# EAGLE design HST1d_2018_FERAL_TECHNOLOGIES (EAGLE 8.6.0)
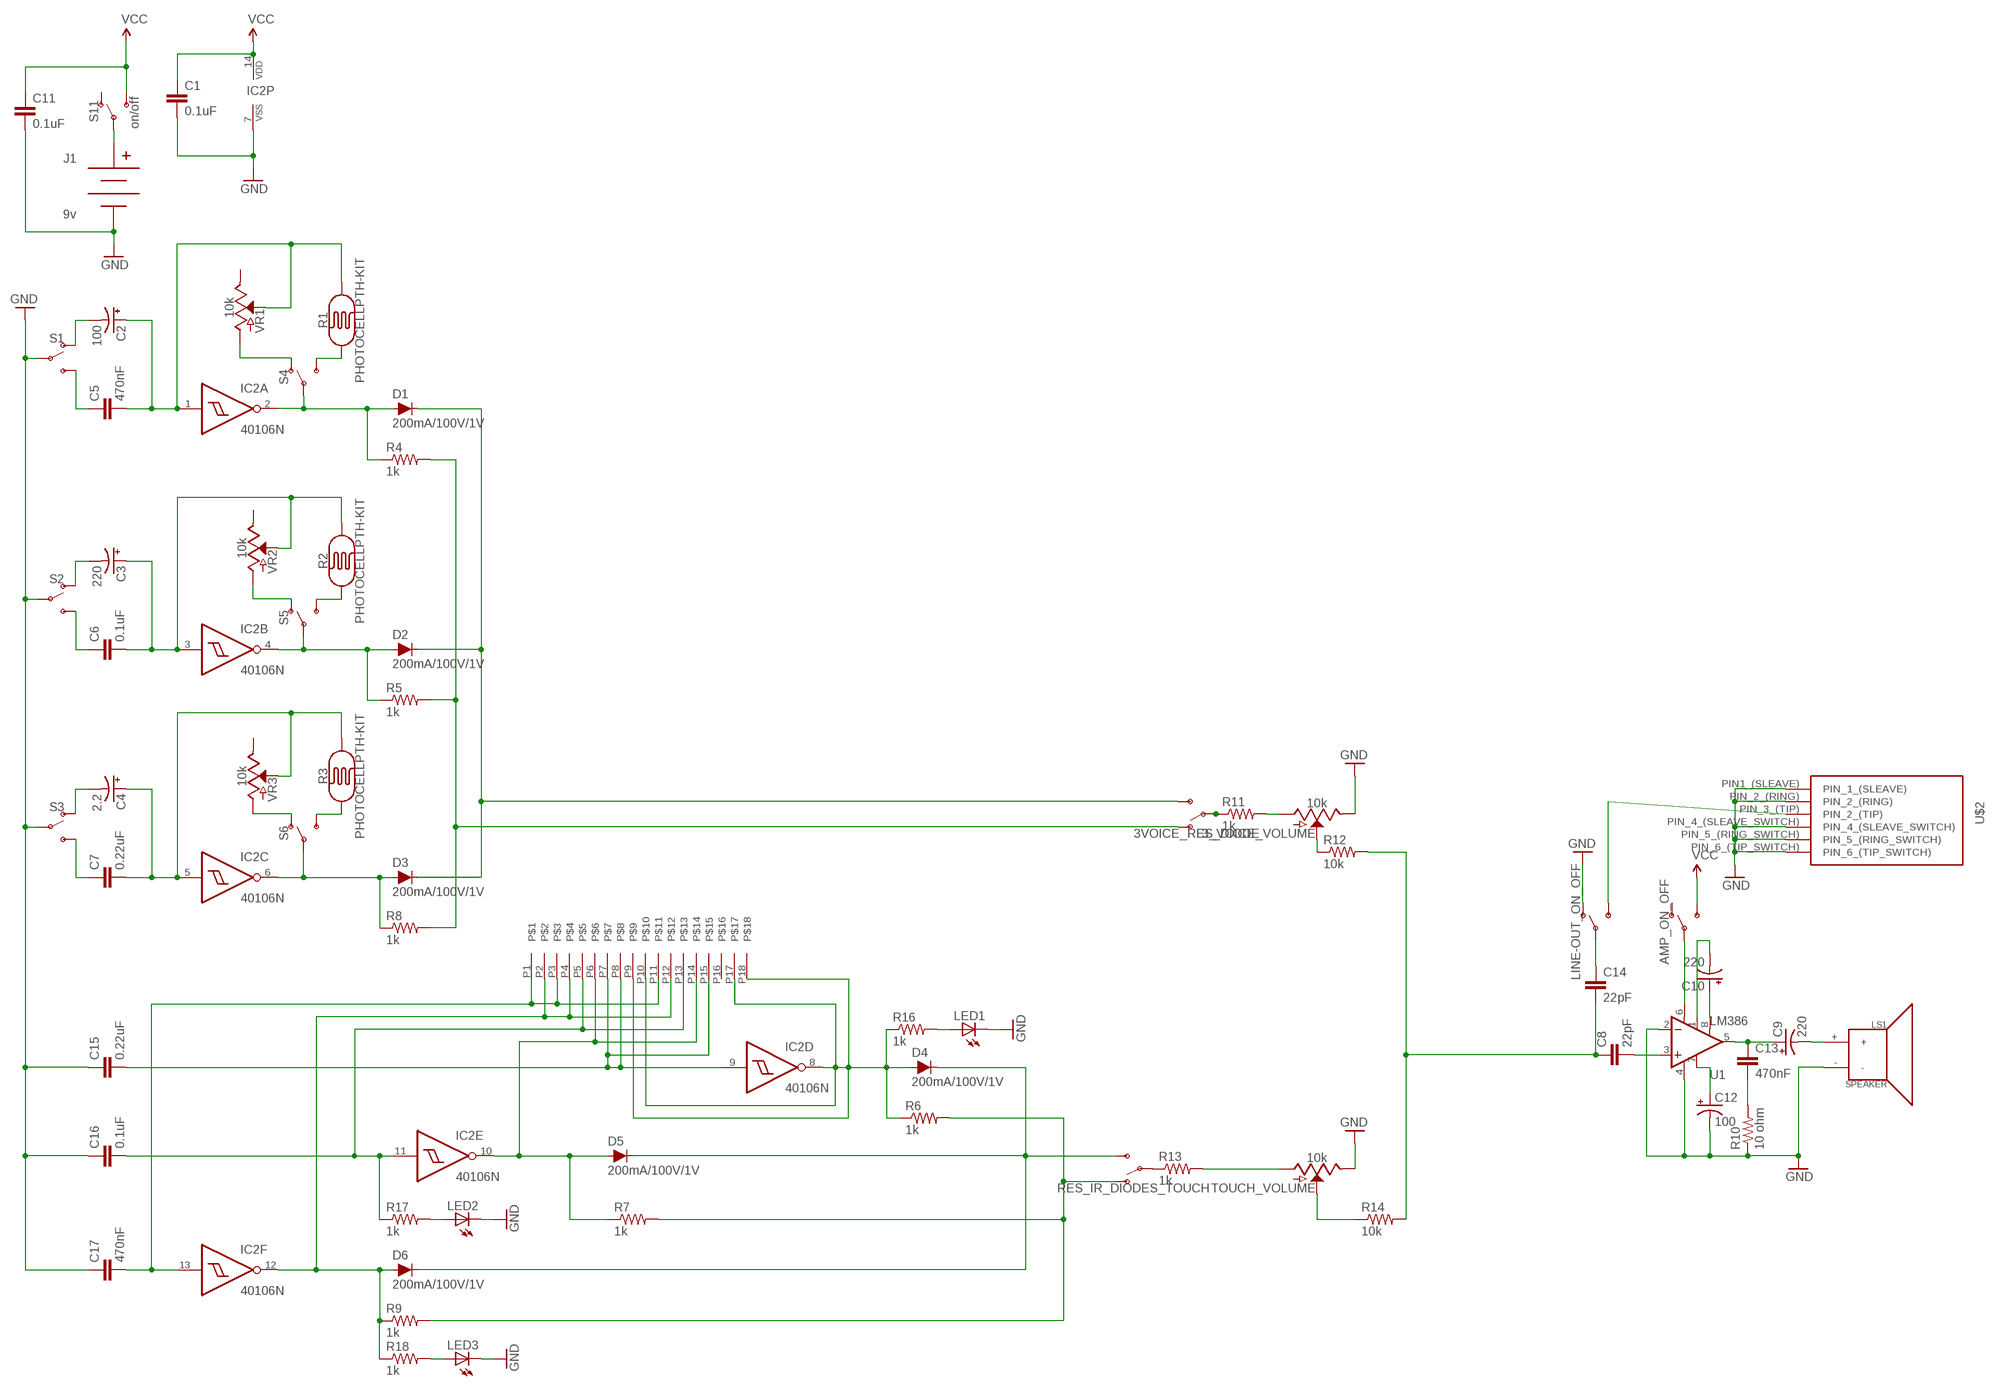
[diagram p0: schematic, sheet 1]

## Parts
3_VOICE_VOLUME  10k  POTENTIOMETER-PTH-9MM-1/20W-20%  [POT-PTH-ALPS]
3VOICE_RES_DIODE  SWITCH-SPDT-PTH-11.6X4.0MM  [SWITCH_SPDT_PTH_11.6X4.0MM]
AMP_ON_OFF  SWITCH-SPDT-PTH-11.6X4.0MM  [SWITCH_SPDT_PTH_11.6X4.0MM]
C1  0.1uF  0.1UF-KIT-EZ-50V-20%  [CAP-PTH-SMALL-KIT]
C2  100  CAP_POLPTH1  [CPOL-RADIAL-100UF-25V]
C3  220  CAP_POLPTH1  [CPOL-RADIAL-100UF-25V]
C4  2.2  CAP_POLPTH1  [CPOL-RADIAL-100UF-25V]
C5  470nF  0.1UF-50V-20%(PTH)KIT-EZ  [CAP-PTH-SMALL-KIT]
C6  0.1uF  0.1UF-50V-20%(PTH)KIT-EZ  [CAP-PTH-SMALL-KIT]
C7  0.22uF  0.1UF-50V-20%(PTH)KIT-EZ  [CAP-PTH-SMALL-KIT]
C8  22pF  22PF-PTH-2.54MM-200V-5%  [CAP-PTH-2.54]
C9  220  CAP_POLPTH1  [CPOL-RADIAL-100UF-25V]
C10  220  CAP_POLPTH1  [CPOL-RADIAL-100UF-25V]
C11  0.1uF  0.1UF-KIT-EZ-50V-20%  [CAP-PTH-SMALL-KIT]
C12  100  CAP_POLPTH1  [CPOL-RADIAL-100UF-25V]
C13  470nF  CAPEZ  [CAP-PTH-SMALLEZ]
C14  22pF  22PF-PTH-2.54MM-200V-5%  [CAP-PTH-2.54]
C15  0.22uF  0.1UF-50V-20%(PTH)KIT-EZ  [CAP-PTH-SMALL-KIT]
C16  0.1uF  0.1UF-50V-20%(PTH)KIT-EZ  [CAP-PTH-SMALL-KIT]
C17  470nF  0.1UF-50V-20%(PTH)KIT-EZ  [CAP-PTH-SMALL-KIT]
D1  200mA/100V/1V  DIODE-1N4148  [DIODE-1N4148]
D2  200mA/100V/1V  DIODE-1N4148  [DIODE-1N4148]
D3  200mA/100V/1V  DIODE-1N4148  [DIODE-1N4148]
D4  200mA/100V/1V  DIODE-1N4148  [DIODE-1N4148]
D5  200mA/100V/1V  DIODE-1N4148  [DIODE-1N4148]
D6  200mA/100V/1V  DIODE-1N4148  [DIODE-1N4148]
IC2  40106N  [DIL14]
J1  9v  BC9VPC  [BC9VPC]
LED1  LED5MM  [LED5MM]
LED2  LED5MM  [LED5MM]
LED3  LED5MM  [LED5MM]
LINE-OUT_ON_OFF  SWITCH-SPDT-PTH-11.6X4.0MM  [SWITCH_SPDT_PTH_11.6X4.0MM]
LS1  SPEAKER  [PCB_MOUNT_SPEAKER]
R1  PHOTOCELLPTH-KIT  [PHOTOCELL-KIT]
R2  PHOTOCELLPTH-KIT  [PHOTOCELL-KIT]
R3  PHOTOCELLPTH-KIT  [PHOTOCELL-KIT]
R4  1k  RESISTORPTH-1/4W  [AXIAL-0.4]
R5  1k  RESISTORPTH-1/4W  [AXIAL-0.4]
R6  1k  RESISTORPTH-1/4W  [AXIAL-0.4]
R7  1k  RESISTORPTH-1/4W  [AXIAL-0.4]
R8  1k  RESISTORPTH-1/4W  [AXIAL-0.4]
R9  1k  RESISTORPTH-1/4W  [AXIAL-0.4]
R10  10 ohm  RESISTORPTH-1/4W  [AXIAL-0.4]
R11  1k  RESISTORPTH-1/4W  [AXIAL-0.4]
R12  10k  RESISTORPTH-1/4W  [AXIAL-0.4]
R13  1k  RESISTORPTH-1/4W  [AXIAL-0.4]
R14  10k  RESISTORPTH-1/4W  [AXIAL-0.4]
R16  1k  RESISTORPTH-1/4W  [AXIAL-0.4]
R17  1k  RESISTORPTH-1/4W  [AXIAL-0.4]
R18  1k  RESISTORPTH-1/4W  [AXIAL-0.4]
RES_IR_DIODES_TOUCH  SWITCH-SPDT-PTH-11.6X4.0MM  [SWITCH_SPDT_PTH_11.6X4.0MM]
S1  SWITCH-SPDT-PTH-11.6X4.0MM  [SWITCH_SPDT_PTH_11.6X4.0MM]
S2  SWITCH-SPDT-PTH-11.6X4.0MM  [SWITCH_SPDT_PTH_11.6X4.0MM]
S3  SWITCH-SPDT-PTH-11.6X4.0MM  [SWITCH_SPDT_PTH_11.6X4.0MM]
S4  SWITCH-SPDT-PTH-11.6X4.0MM  [SWITCH_SPDT_PTH_11.6X4.0MM]
S5  SWITCH-SPDT-PTH-11.6X4.0MM  [SWITCH_SPDT_PTH_11.6X4.0MM]
S6  SWITCH-SPDT-PTH-11.6X4.0MM  [SWITCH_SPDT_PTH_11.6X4.0MM]
S11  on/off  SWITCH-SPDT-PTH-11.6X4.0MM  [SWITCH_SPDT_PTH_11.6X4.0MM]
TOUCH_VOLUME  10k  POTENTIOMETER-PTH-9MM-1/20W-20%  [POT-PTH-ALPS]
U1  LM386  [DIP08]
U$1  MT_TOUCH_POINT  [TOUCH_POINT]
U$2  0.25_INCH_TRS_SWITCHED_AUDIO_SOCKET  [0.25INCH_AUDIO_SOCKET]
VR1  10k  POTENTIOMETER-PTH-9MM-1/20W-20%  [POT-PTH-ALPS]
VR2  10k  POTENTIOMETER-PTH-9MM-1/20W-20%  [POT-PTH-ALPS]
VR3  10k  POTENTIOMETER-PTH-9MM-1/20W-20%  [POT-PTH-ALPS]

## Nets
GND: 3_VOICE_VOLUME.P$1(E) C1.2 C11.2 C12.2(-) C15.1 C16.1 C17.1 IC2.7(P:VSS) J1.V- LED1.K(C) LED2.K(C) LED3.K(C) LINE-OUT_ON_OFF.1(O) LS1.- R10.P$1 S1.2(P) S2.2(P) S3.2(P) TOUCH_VOLUME.P$1(E) U1.2(-IN) U1.4(V-) U$2.PIN1_(SLEAVE)(PIN_1_(SLEAVE)) U$2.PIN_2_(RING) U$2.PIN_4_(SLEAVE_SWITCH) U$2.PIN_5_(RING_SWITCH) U$2.PIN_6_(TIP_SWITCH)
N$1: C2.2(-) S1.1(O)
N$2: C3.2(-) S2.1(O)
N$3: C4.2(-) S3.1(O)
N$4: C5.1 S1.3(S)
N$5: C2.1(+) C5.2 IC2.1(A:I) R1.2 VR1.P$2(S)
N$6: C6.1 S2.3(S)
N$7: D2.A IC2.4(B:O) R5.P$1 S5.2(P)
N$8: C7.1 S3.3(S)
N$9: R1.1 S4.3(S)
N$10: D3.A IC2.6(C:O) R8.P$1 S6.2(P)
N$11: S4.1(O) VR1.P$3(A)
N$12: D1.A IC2.2(A:O) R4.P$1 S4.2(P)
N$13: R6.P$2 R7.P$2 R9.P$2 RES_IR_DIODES_TOUCH.1(O)
N$14: S5.1(O) VR2.P$3(A)
N$15: R2.1 S5.3(S)
N$16: R3.1 S6.3(S)
N$17: C3.1(+) C6.2 IC2.3(B:I) R2.2 VR2.P$2(S)
N$18: C4.1(+) C7.2 IC2.5(C:I) R3.2 VR3.P$2(S)
N$19: 3_VOICE_VOLUME.P$2(S) R12.P$1
N$20: 3VOICE_RES_DIODE.3(S) D1.C D2.C D3.C
N$21: LINE-OUT_ON_OFF.3(S) U$2.PIN_3_(TIP)(PIN_2_(TIP))
N$22: R14.P$1 TOUCH_VOLUME.P$2(S)
N$23: 3VOICE_RES_DIODE.1(O) R4.P$2 R5.P$2 R8.P$2
N$24: C15.2 IC2.9(D:I) U$1.P7 U$1.P8 U$1.P15
N$25: C14.1 LINE-OUT_ON_OFF.2(P)
N$26: LED2.A R17.P$2
N$27: C9.1(+) C13.1 U1.5(OUT)
N$28: D4.A IC2.8(D:O) R6.P$1 R16.P$1 U$1.P9 U$1.P10 U$1.P17 U$1.P18
N$29: J1.V+ S11.2(P)
N$30: D5.A IC2.10(E:O) R7.P$1 U$1.P6 U$1.P14
N$31: R13.P$2 TOUCH_VOLUME.P$3(A)
N$32: C8.2 U1.3(+IN)
N$33: C9.2(-) LS1.+
N$34: C12.1(+) U1.7(BP)
N$35: S6.1(O) VR3.P$3(A)
N$36: C10.1(+) U1.8(GAIN)
N$37: C10.2(-) U1.1(GAIN)
N$38: C13.2 R10.P$2
N$39: C8.1 C14.2 R12.P$2 R14.P$2
N$40: D6.A IC2.12(F:O) R9.P$1 R18.P$1 U$1.P2 U$1.P4 U$1.P12
N$41: AMP_ON_OFF.2(P) U1.6(V+)
N$42: LED1.A R16.P$2
N$43: D4.C D5.C D6.C RES_IR_DIODES_TOUCH.3(S)
N$44: C16.2 IC2.11(E:I) R17.P$1 U$1.P5 U$1.P13
N$45: R13.P$1 RES_IR_DIODES_TOUCH.2(P)
N$46: C17.2 IC2.13(F:I) U$1.P1 U$1.P3 U$1.P11
N$47: LED3.A R18.P$2
N$48: 3_VOICE_VOLUME.P$3(A) R11.P$2
RES_OR_DIODES_3_VOICES: 3VOICE_RES_DIODE.2(P) R11.P$1
VCC: AMP_ON_OFF.3(S) C1.1 C11.1 IC2.14(P:VDD) S11.3(S)
Unconnected: AMP_ON_OFF.1(O) S11.1(O) U$1.P16 VR1.P$1(E) VR2.P$1(E) VR3.P$1(E)

## Library data of the parts
3_VOICE_VOLUME TOUCH_VOLUME VR1-VR3 = SparkFun-Resistors:POTENTIOMETER: Potentiometer (Pot) Three-terminal potentiometers, with an adjustable wiper and two adjustable resistors. A pot can be used to create a configurable voltage divider, or as a variable resistor. Variants ALPS_POT and ALPS_POT_KIT - PTH, breadboard compatible, 9mm square pots Rotary Potentiometer - Linear (10k ohm) <https://www.sparkfun.com/products/9288> (COM-09288) The KIT variant exposes copper on only one side of the PTH pad, so the part can only be assembled on one side of the PCB. Useful for beginner soldering kits.; PROD_ID: RES-09177; SF_SKU: COM-09288
3VOICE_RES_DIODE AMP_ON_OFF LINE-OUT_ON_OFF RES_IR_DIODES_TOUCH S1-S6 S11 = SparkFun-Switches:SWITCH-SPDT: Single Pole, Double Throw (SPDT) Switch Single-pole, double-throw (SPDT) switch. Variant Overview SMD-AYZ0202 Surface Mount DPDT Switch <https://www.sparkfun.com/products/597> (COM-00597) Used on e.g. LilyPad Arduino USB - ATmega32U4 Board <https://www.sparkfun.com/products/12049> PTH-11.6X4.0MM SPDT Mini Power Switch <https://www.sparkfun.com/products/102> (COM-00102) Used on e.g. SparkFun Simon Says - Through-Hole Soldering Kit <https://www.sparkfun.com/products/10547> (KIT-10547) PTH-11.6X4.0MM-KIT KIT version of SPDT Mini Power Switch - Simplifies soldering by removing tStop of switch pins - only one side can be soldered. PTH-11.6X4.0MM-LOCK LOCK version of SPDT Mini Power Switch - Offset pins hold switch in place for easier soldering. SMD-RIGHT-ANGLE Surface Mount Right Angle Switch <https://www.sparkfun.com/products/10860> (COM-10860) Used on e.g. SparkFun ESP8266 Thing <https://www.sparkfun.com/products/13231>; PROD_ID: SWCH-08261; SF_SKU: COM-00102
C1 C11 = SparkFun-Capacitors:0.1UF: 0.1µF ceramic capacitors A capacitor is a passive two-terminal electrical component used to store electrical energy temporarily in an electric field.; PROD_ID: CAP-08370
C2-C4 C10 = SparkFun-Capacitors:CAP_POL: Capacitor Polarized These are standard SMD and PTH capacitors. Normally 10uF, 47uF, and 100uF in electrolytic and tantalum varieties. Always verify the external diameter of the through hole cap, it varies with capacity, voltage, and manufacturer. The EIA devices should be standard.
C5-C7 C15-C17 = SparkFun-Capacitors:0.1UF-50V-20%(PTH): CAP-08370; PROD_ID: CAP-08370
C8 C14 = SparkFun-Capacitors:22PF: 22pF ceramic capacitors A capacitor is a passive two-terminal electrical component used to store electrical energy temporarily in an electric field.; PROD_ID: CAP-09128
C9 C12 = SparkFun-Passives:CAP_POL: Capacitor Polarized These are standard SMD and PTH capacitors. Normally 10uF, 47uF, and 100uF in electrolytic and tantalum varieties. Always verify the external diameter of the through hole cap, it varies with capacity, voltage, and manufacturer. The EIA devices should be standard.
C13 = SparkFun-Capacitors:CAP: Capacitor Standard 0603 ceramic capacitor, and 0.1" leaded capacitor.
D1-D6 = SparkFun-DiscreteSemi:DIODE: Diode These are standard reverse protection diodes and small signal diodes. SparkFun Products: SparkFun SparkPunk Sound Kit <https://www.sparkfun.com/products/11177> SparkFun ESP8266 Thing <https://www.sparkfun.com/products/13231>; PROD_ID: DIO-08378
IC2 = 40xx:40106: Hex SCHMITT TRIGGER
J1 = SparkFun-Connectors:BC9VPC: 9V Battery Holder - PC Mount Standard and Kit footprints included SparkFun Products: SparkFun SparkPunk Sound Kit <https://www.sparkfun.com/products/11177> SparkFun SparkPunk Sequencer Kit <https://www.sparkfun.com/products/12707>; PROD_ID: BATT-10855
LED1-LED3 = led:LED: LED OSRAM: - CHIPLED LG R971, LG N971, LY N971, LG Q971, LY Q971, LO R971, LY R971 LH N974, LH R974 LS Q976, LO Q976, LY Q976 LO Q996 - Hyper CHIPLED LW Q18S LB Q993, LB Q99A, LB R99A - SideLED LS A670, LO A670, LY A670, LG A670, LP A670 LB A673, LV A673, LT A673, LW A673 LH A674 LY A675 LS A676, LA A676, LO A676, LY A676, LW A676 LS A679, LY A679, LG A679 - Hyper Micro SIDELED® LS Y876, LA Y876, LO Y876, LY Y876 LT Y87S - SmartLED LW L88C, LW L88S LB L89C, LB L89S, LG L890 LS L89K, LO L89K, LY L89K LS L896, LA L896, LO L896, LY L896 - TOPLED LS T670, LO T670, LY T670, LG T670, LP T670 LSG T670, LSP T670, LSY T670, LOP T670, LYG T670 LG T671, LOG T671, LSG T671 LB T673, LV T673, LT T673, LW T673 LH T674 LS T676, LA T676, LO T676, LY T676, LB T676, LH T676, LSB T676, LW T676 LB T67C, LV T67C, LT T67C, LS T67K, LO T67K, LY T67K, LW E67C LS E67B, LA E67B, LO E67B, LY E67B, LB E67C, LV E67C, LT E67C LW T67C LS T679, LY T679, LG T679 LS T770, LO T770, LY T770, LG T770, LP T770 LB T773, LV T773, LT T773, LW T773 LH T774 LS E675, LA E675, LY E675, LS T675 LS T776, LA T776, LO T776, LY T776, LB T776 LHGB T686 LT T68C, LB T68C - Hyper Mini TOPLED® LB M676 - Mini TOPLED Santana® LG M470 LS M47K, LO M47K, LY M47K Source: http://www.osram.convergy.de LUXEON: - LUMILED® LXK2-PW12-R00, LXK2-PW12-S00, LXK2-PW14-U00, LXK2-PW14-V00 LXK2-PM12-R00, LXK2-PM12-S00, LXK2-PM14-U00 LXK2-PE12-Q00, LXK2-PE12-R00, LXK2-PE12-S00, LXK2-PE14-T00, LXK2-PE14-U00 LXK2-PB12-K00, LXK2-PB12-L00, LXK2-PB12-M00, LXK2-PB14-N00, LXK2-PB14-P00, LXK2-PB14-Q00 LXK2-PR12-L00, LXK2-PR12-M00, LXK2-PR14-Q00, LXK2-PR14-R00 LXK2-PD12-Q00, LXK2-PD12-R00, LXK2-PD12-S00 LXK2-PH12-R00, LXK2-PH12-S00 LXK2-PL12-P00, LXK2-PL12-Q00, LXK2-PL12-R00 Source: www.luxeon.com KINGBRIGHT: KA-3528ASYC Source: www.kingbright.com
LS1 = SparkFun-Electromechanical:SPEAKER: Speaker Generic 2-terminal loudspeakers SparkFun Products Speaker - PCB Mount <https://www.sparkfun.com/products/11089> (COM-11089); PROD_ID: COMP-11789; SF_SKU: COM-11089
R1-R3 = SparkFun-Sensors:PHOTOCELL: Photocell (Photodetector, Photo Resistor, CdS) This is a very small light sensor. A photocell changes (also called a photodetector, photo resistor, CdS or photoconductive cell) resistance depending on the amount of light it is exposed to. These little sensors make great ambient light triggers (when light in the room turns on, do something). Datasheet <http://cdn.sparkfun.com/datasheets/Sensors/LightImaging/SEN-09088.pdf> SparkFun Products Mini Photocell <https://www.sparkfun.com/products/9088> (SEN-09088); PROD_ID: COMP-09129; SF_ID: SEN-09088
R4-R14 R16-R18 = SparkFun-Passives:RESISTOR: Resistor Basic schematic elements and footprints for 0603, 1206, and PTH resistors.
U1 = SparkFun-AnalogIC:LM386: low voltage audio power amplifier
U$1 = library_JF:MT_TOUCH_POINT
U$2 = library_JF:0.25_INCH_TRS_SWITCHED_AUDIO_SOCKET

## Board
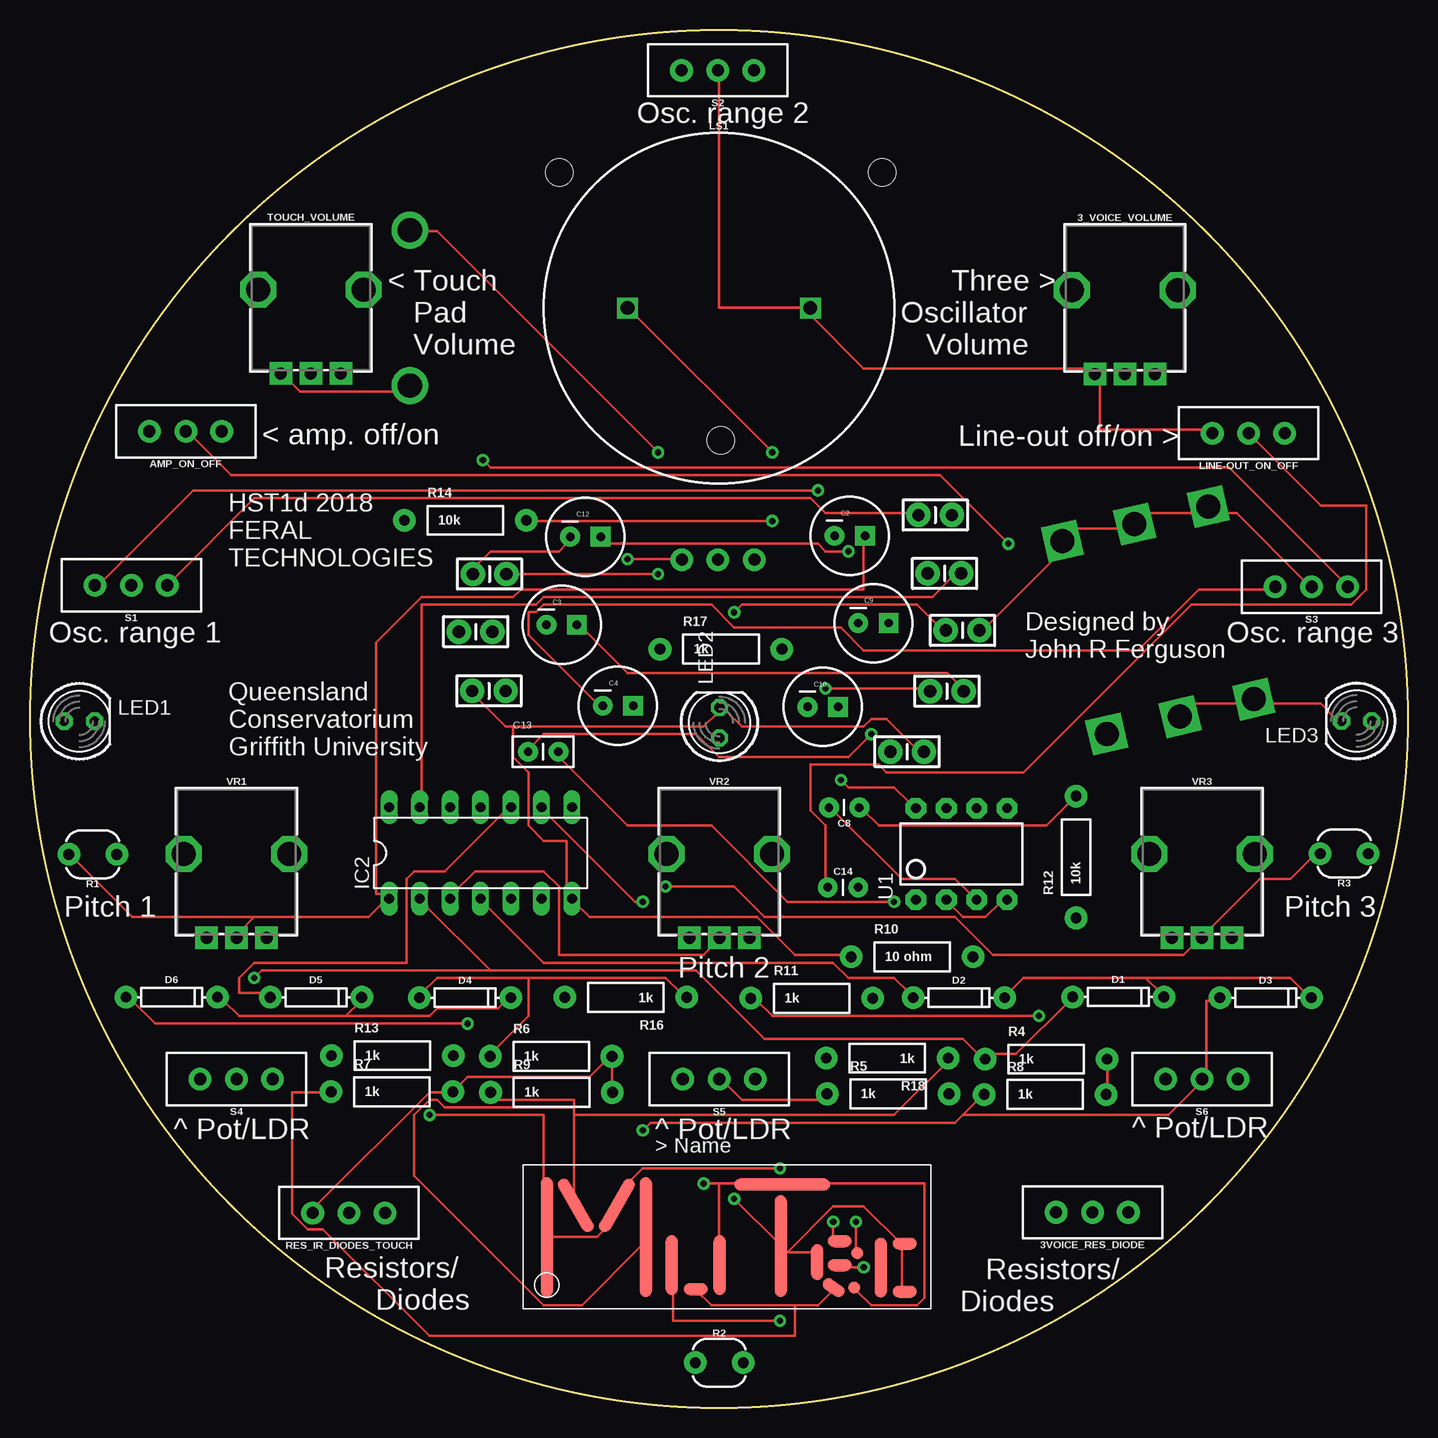
[diagram p1: board, top side]
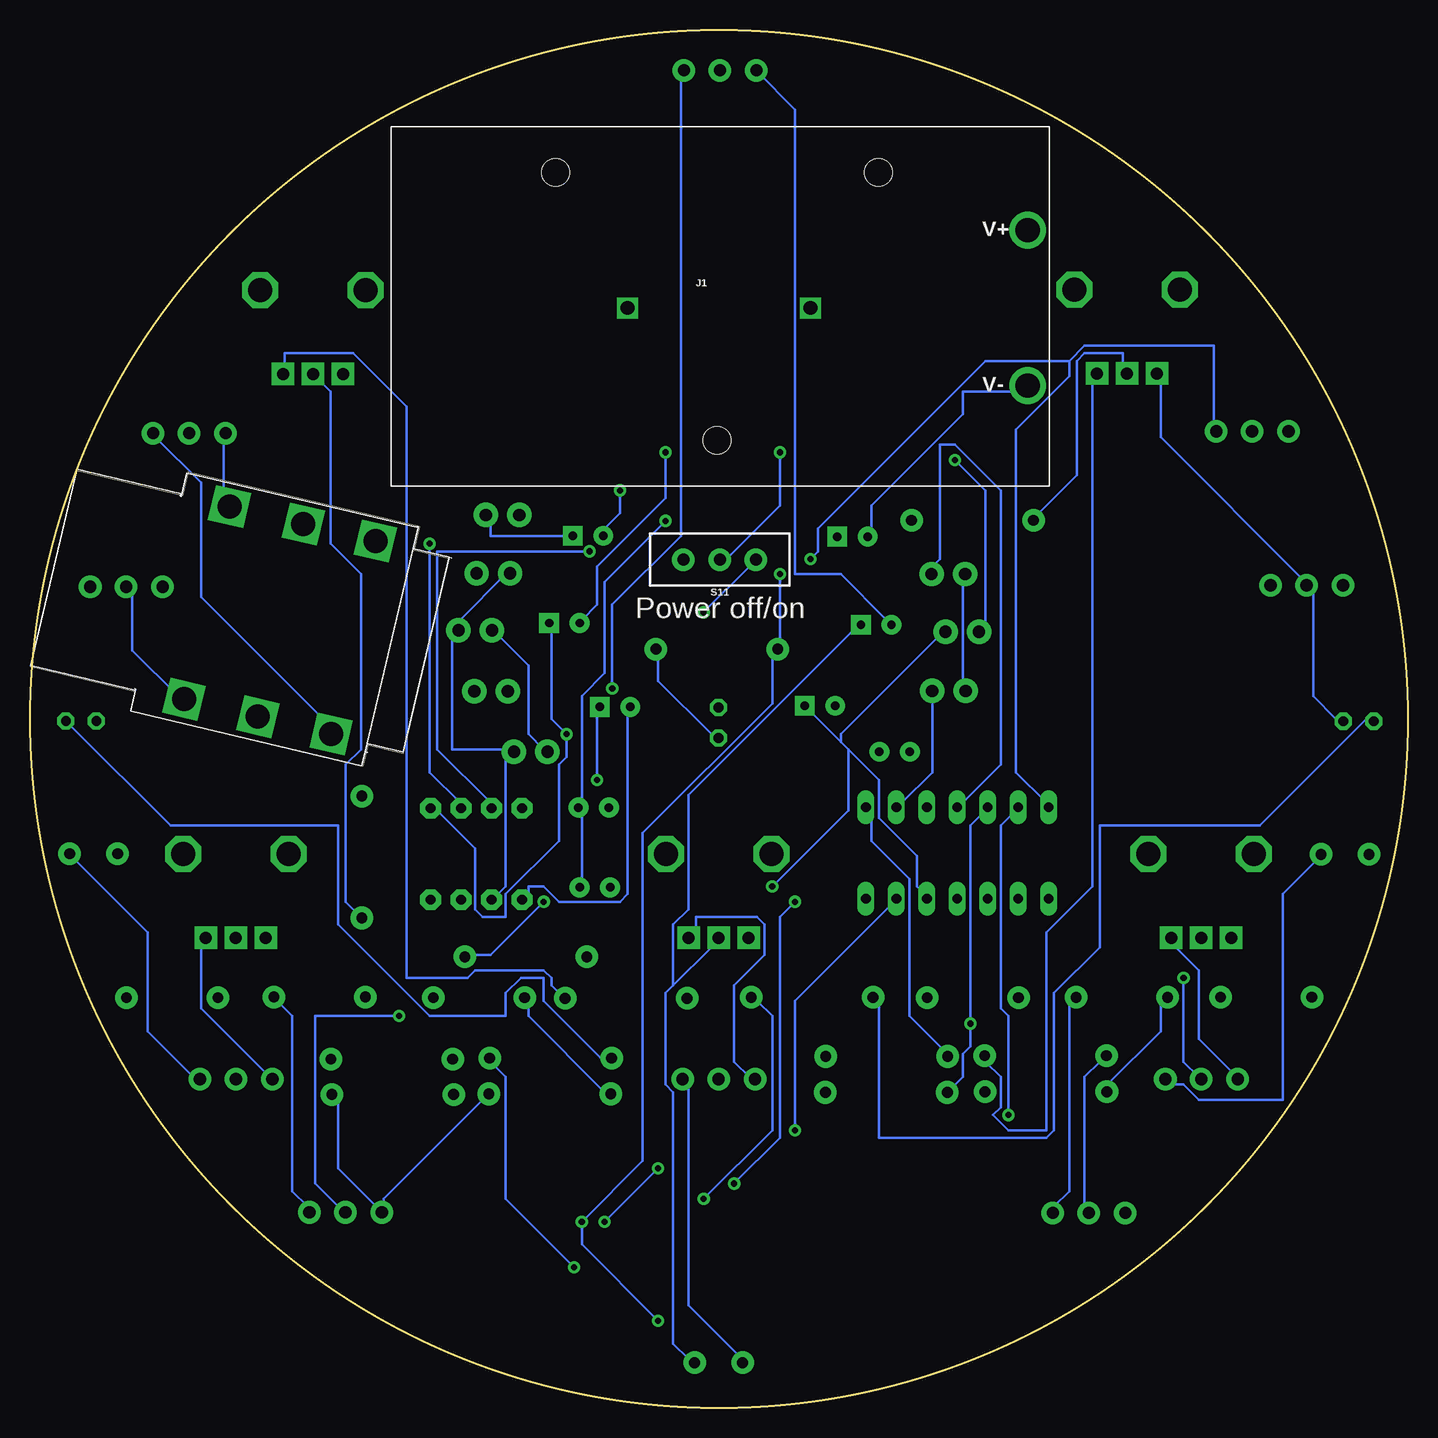
[diagram p2: board, bottom side, seen from below]

Size 114.86 x 114.86 mm. Coordinates in mm from the lower left corner, seen from the top.
Outline: circle at 57.43,57.43 radius 57.43
Copper layers (1*16): Top 0.035mm / dielectric 1.5mm / Bottom 0.035mm
Design rules "SparkFun": minimum track width 8mil, minimum drill 20mil, track to track 8mil, track to pad 8mil, pad to pad 8mil, via to via 8mil, smd to smd 8mil, copper to edge 8mil, drill to drill 8mil, minimum pad ring 12mil, minimum via ring 10mil, stop-mask expansion 4mil, vias tented up to drill 20mil, thermal gap 10mil

### Footprints (pad centres in the part's own frame; a part is rotated, then mirrored left to right if it is on the bottom)
POT-PTH-ALPS = drill 1 pad 1.88 square: P$1 7,-2.5; P$2 7,0; P$3 7,2.5 | drill 2 octagon: P$4 0,-4.4; P$5 0,4.4
SWITCH_SPDT_PTH_11.6X4.0MM = drill 1.016 pad 1.88: 1 0,3.04; 2 0,0; 3 0,-2.997
CAP-PTH-SMALL-KIT = drill 1.016 pad 2.032: 1 -1.397,0; 2 1.397,0
CPOL-RADIAL-100UF-25V = drill 0.7 pad 1.651 square: 1 1.27,0 | drill 0.7 pad 1.651: 2 -1.27,0
CAP-PTH-2.54 = drill 0.7 pad 1.651: 1 -1.27,0; 2 1.27,0
CAP-PTH-SMALLEZ = drill 0.7 pad 1.651: 1 0,0; 2 2.54,0
DIODE-1N4148 = drill 0.9 pad 1.88: A -3.81,0; C 3.81,0
DIL14 = drill 0.813 long: 1 -7.62,-3.81; 2 -5.08,-3.81; 3 -2.54,-3.81; 4 0,-3.81; 5 2.54,-3.81; 6 5.08,-3.81; 7 7.62,-3.81; 8 7.62,3.81; 9 5.08,3.81; 10 2.54,3.81; 11 0,3.81; 12 -2.54,3.81; 13 -5.08,3.81; 14 -7.62,3.81
BC9VPC = drill 2.032: V+ 53.086,21.336; V- 53.086,8.382 | hole 2.286: 27.178,3.81; 13.716,26.162; 40.64,26.162
LED5MM = drill 0.813 octagon: A -1.27,0; K 1.27,0
PCB_MOUNT_SPEAKER = drill 1.143 square: + -7.62,0; - 7.62,0
PHOTOCELL-KIT = drill 0.9 pad 1.88: 1 -2,0; 2 2,0
AXIAL-0.4 = drill 0.9 pad 1.88: P$1 -5.08,0; P$2 5.08,0
DIP08 = drill 0.813 pad 1.727 octagon: 1 -3.81,-3.81; 2 -1.27,-3.81; 3 1.27,-3.81; 4 3.81,-3.81; 5 3.81,3.81; 6 1.27,3.81; 7 -1.27,3.81; 8 -3.81,3.81
TOUCH_POINT = smd 1 x 10: P1 -1,-2; P4 7.239,-2.032 | smd 5 x 1 rotated 120: P2 1.381,0.635 | smd 5 x 1 rotated 60: P3 4.826,0.635 | smd 1 x 5: P5 9.381,-4.365; P7 13.381,-4.365; P16 26.829,-4.556 | smd 2 x 1: P6 11.381,-6.365; P11 23.381,-2.365; P12 23.381,-4.365; P17 28.829,-6.556; P18 28.829,-2.556 | smd 8 x 1: P8 18.619,2.365 | smd 1 x 8.5: P9 18.493,-2.762 | smd 1 x 3: P10 21.508,-4.111 | smd 1 x 1: P13 24.873,-3.365; P15 24.619,-6.238 | smd 2 x 1 rotated 325: P14 22.889,-6.238
0.25INCH_AUDIO_SOCKET = drill 2 pad 3 square: PIN1_(SLEAVE) 0,0; PIN_2_(RING) 6.324,0; PIN_3_(TIP) 12.6,0; PIN_4_(SLEAVE_SWITCH) 0,16.5; PIN_5_(RING_SWITCH) 6.324,16.5; PIN_6_(TIP_SWITCH) 12.5,16.5

### Placement (x,y rotation side)
3_VOICE_VOLUME  91.27,93.19 270 top
3VOICE_RES_DIODE  88.57,16.3 90 top
AMP_ON_OFF  12.98,81.41 90 top
C1  77.74,64.82 0 top
C2  68.34,72.7 0 top
C3  44.32,65.28 0 top
C4  49.01,58.54 0 top
C5  75.46,74.43 0 top
C6  76.43,59.74 0 top
C7  37.15,64.7 0 top
C8  67.87,50.04 180 top
C9  70.31,65.42 0 top
C10  66.09,58.43 0 top
C11  73.12,54.7 0 top
C12  46.3,72.62 0 top
C13  41.52,54.7 0 top
C14  67.77,43.39 0 top
C15  38.25,59.77 0 top
C16  38.31,69.51 0 top
C17  76.24,69.57 0 top
D1  90.72,34.26 0 top
D2  77.43,34.19 0 top
D3  103.01,34.19 0 top
D4  36.27,34.19 0 top
D5  23.84,34.22 0 top
D6  11.81,34.24 0 top
IC2  37.56,46.25 0 top
J1  84.77,76.84 0 bottom
LED1  4.11,57.24 0 top
LED2  57.47,57.11 90 top
LED3  110.6,57.25 180 top
LINE-OUT_ON_OFF  101.6,81.25 90 top
LS1  57.43,91.69 0 top
R1  5.24,46.14 180 top
R2  57.46,3.76 0 top
R3  109.56,46.2 180 top
R4  84.7,29.07 0 top
R5  71.53,26.18 0 top
R6  43.44,29.3 0 top
R7  30.17,26.35 0 top
R8  84.62,26.13 0 top
R9  43.48,26.3 0 top
R10  73.53,37.6 0 top
R11  65.17,34.14 0 top
R12  87.2,45.92 90 top
R13  30.2,29.36 0 top
R14  36.29,73.99 0 top
R16  49.67,34.22 180 top
R17  57.6,63.25 0 top
R18  71.46,29.15 180 top
RES_IR_DIODES_TOUCH  26.6,16.25 90 top
S1  8.44,68.57 90 top
S2  57.35,111.5 90 top
S3  106.84,68.45 90 top
S4  17.22,27.41 90 top
S5  57.46,27.41 90 top
S6  97.7,27.41 90 top
S11  57.35,70.71 90 bottom
TOUCH_VOLUME  23.41,93.22 270 top
U1  77.66,46.17 0 top
U$1  44.1,16.25 0 top
U$2  102.02,59.08 346.7 bottom
VR1  17.22,46.19 270 top
VR2  57.46,46.19 270 top
VR3  97.7,46.19 270 top

### Tracks (layer width: path | path; a pad name or v marks a point on that pad's centre or on a via)
GND
  Top 0.203: TOUCH_VOLUME.P$1 21.24,86.01 22.51,84.74 31.4,84.74 J1.V- | R10.P$1 68.23,37.75 63.78,37.75 60.61,40.92 46.64,40.92 45.37,42.19 IC2.7 44.73,42.83 44.73,47.27 42.83,47.27 41.56,48.54 41.56,52.99 40.29,54.26 40.29,56.8 | C12.2 44.73,72.04 44.1,71.4 38.38,71.4 37.11,70.13 C16.1 | 40.29,56.8 39.65,56.8 37.11,59.34 C15.1 | 40.29,56.8 56.16,56.8 57.43,58.07 LED2.K 58.07,58.07 59.34,56.8 69.5,56.8 70.13,57.43 71.4,57.43 73.94,54.89 C11.2 | S2.2 57.43,111.41 57.43,91.72 64.42,91.72 LS1.- 65.05,91.09 69.5,86.64 88.55,86.64 3_VOICE_VOLUME.P$1 89.18,86.01 89.18,81.56 98.07,81.56 LINE-OUT_ON_OFF.1 | U1.2 76.48,42.19 77.75,40.92 79.66,40.92 80.93,42.19 U1.4 | LED3.K 108.87,57.43 107.6,58.7 102.52,58.7 U$2.PIN1_(SLEAVE) 101.88,58.7 96.8,58.7 96.17,58.07 U$2.PIN_2_(RING) | S3.2 106.33,68.86 100.61,74.58 98.71,74.58 U$2.PIN_4_(SLEAVE_SWITCH) 98.07,74.58 92.99,74.58 92.36,73.94 U$2.PIN_5_(RING_SWITCH) 91.72,73.31 87.28,73.31 86.64,72.67 U$2.PIN_6_(TIP_SWITCH) 86.64,72.04 79.66,65.05 C1.2
  Bottom 0.203: LED1.K 6,57.43 7.9,59.34 7.9,68.23 S1.2 8.54,68.86 20.6,80.93 20.6,86.01 TOUCH_VOLUME.P$1 | C16.1 37.11,69.5 37.11,59.97 C15.1 | J1.V- 32.03,84.74 37.11,84.74 37.11,82.83 44.73,75.21 44.73,72.67 C12.2 | 75.21,54.89 79.66,54.89 79.66,64.42 C1.2 79.02,65.05 79.02,65.69 75.21,69.5 C17.1 | 75.21,54.89 74.58,54.89 C11.2 75.21,54.89 | 75.21,54.89 75.21,43.46 75.85,42.83 U1.2 | LINE-OUT_ON_OFF.1 98.71,80.93 98.71,75.21 U$2.PIN_4_(SLEAVE_SWITCH) | U$2.PIN1_(SLEAVE) 102.52,59.34 106.33,63.15 106.33,68.23 S3.2
N$1  (via drill 0.51)
  Top 0.203: v65.69,76.48 13.62,76.48 6,68.86 S1.1
  Bottom 0.203: v65.69,76.48 65.69,74.58 66.96,73.31 C2.2
N$2
  Bottom 0.203: C3.2 43.46,65.69 47.27,69.5 51.08,69.5 51.08,108.23 54.26,111.41 S2.1
N$3
  Top 0.203: C4.2 47.27,58.7 41.56,64.42 41.56,66.32 42.19,66.32 42.83,66.96 56.8,66.96 58.7,65.05 67.59,65.05 69.5,63.15 92.36,63.15 97.44,68.23 103.79,68.23 S3.1
N$4
  Top 0.203: S1.3 11.71,68.86 18.7,75.85 65.05,75.85 66.32,74.58 73.94,74.58 C5.1
N$5
  Top 0.203: 18.7,40.92 28.22,40.92 29.49,42.19 IC2.1 29.49,42.83 28.86,42.83 28.86,63.78 32.67,67.59 40.29,67.59 40.92,68.23 69.5,68.23 69.5,72.67 C2.1 | 18.7,40.92 17.43,39.65 VR1.P$2 | 18.7,40.92 8.54,40.92 3.46,46 R1.2
  Bottom 0.203: C2.1 70.13,72.67 76.48,72.67 76.48,73.94 C5.2
N$6  (via drill 0.51)
  Top 0.203: v66.32,59.97 74.58,59.97 C6.1
  Bottom 0.203: v66.32,59.97 66.32,66.96 60.61,72.67 60.61,111.41 S2.3
N$7
  Top 0.203: IC2.4 37.75,42.19 42.83,37.11 66.96,37.11 68.23,35.84 72.04,35.84 73.31,34.57 D2.A | S5.2 58.07,26.95 59.34,25.68 66.32,25.68 R5.P$1
  Bottom 0.203: R5.P$1 66.96,26.32 73.31,32.67 73.31,33.94 D2.A
N$8  (via drill 0.51)
  Top 0.203: v37.75,79.02 38.38,78.39 99.98,78.39 109.5,68.86 S3.3
  Bottom 0.203: v37.75,79.02 35.21,76.48 35.21,65.05 C7.1
N$9
  Bottom 0.203: S4.3 19.97,26.95 18.7,26.95 17.43,25.68 10.44,25.68 10.44,42.83 7.27,46 R1.1
N$10  (via drill 0.51)
  Top 0.203: D3.A 98.71,33.94 98.07,33.94 98.07,27.59 S6.2 97.44,26.95 94.9,24.41 77.75,24.41 | v51.08,23.14 51.72,23.78 77.12,23.78 77.75,24.41 | 77.75,24.41 79.02,25.68 R8.P$1
  Bottom 0.203: v51.08,23.14 51.08,33.94 42.83,42.19 IC2.6
N$11
  Bottom 0.203: S4.1 14.25,27.59 17.43,30.76 17.43,36.48 19.33,38.38 19.33,39.02 VR1.P$3
N$12  (via drill 0.51)
  Top 0.203: 38.38,36.48 32.67,42.19 IC2.2 | 38.38,36.48 55.53,36.48 61.24,30.76 77.75,30.76 79.02,29.49 R4.P$1 79.66,29.49 82.2,29.49 86.64,33.94 D1.A | v18.7,35.84 19.33,36.48 38.38,36.48
  Bottom 0.203: v18.7,35.84 18.7,28.86 17.43,27.59 S4.2
N$13
  Top 0.203: R9.P$2 48.54,26.32 48.54,28.86 R6.P$2 47.91,28.86 46.64,27.59 36.48,27.59 35.84,26.95 R7.P$2 35.21,26.32 33.3,26.32 23.78,16.79 RES_IR_DIODES_TOUCH.1
N$14
  Bottom 0.203: S5.1 54.89,27.59 56.16,28.86 56.16,35.21 53.62,37.75 53.62,40.29 54.26,40.92 59.34,40.92 59.34,39.65 VR2.P$3
N$15
  Bottom 0.203: R2.1 55.53,4.09 59.97,8.54 59.97,26.95 S5.3
N$16
  Bottom 0.203: S6.3 101.25,27.59 105.06,31.4 105.06,39.65 111.41,46 R3.1
N$17
  Top 0.203: C3.1 46,65.05 49.81,61.24 76.48,61.24 77.75,59.97 C6.2 | IC2.3 35.21,42.83 37.11,44.73 42.83,44.73 44.1,43.46 44.1,37.75 56.16,37.75 57.43,39.02 VR2.P$2
  Bottom 0.203: 61.24,35.21 58.07,38.38 58.07,39.02 VR2.P$2 | 61.24,35.21 61.88,34.57 61.88,26.95 61.24,26.32 61.24,5.36 59.97,4.09 R2.2 | 61.24,35.21 61.24,40.29 59.97,41.56 59.97,51.08 46,65.05 C3.1
N$18  (via drill 0.51)
  Top 0.203: R3.2 106.96,46 105.06,44.1 102.52,44.1 98.07,39.65 VR3.P$2 97.44,39.02 96.17,37.75 80.29,37.75 77.12,40.92 61.24,40.92 58.7,43.46 v52.99,43.46
  Bottom 0.203: 47.27,55.53 49.81,58.07 C4.1 | 47.27,55.53 46.64,54.89 | 46.64,54.89 44.1,52.35 44.1,49.18 40.92,46 40.92,43.46 40.29,42.83 IC2.5 | 47.27,55.53 47.27,56.16 39.02,64.42 C7.2 | v52.99,43.46 46.64,49.81 46.64,54.89
N$19
  Bottom 0.203: R12.P$1 87.28,40.92 88.55,42.19 88.55,53.62 87.28,54.89 87.28,69.5 89.82,72.04 89.82,84.74 91.09,86.01 3_VOICE_VOLUME.P$2
N$20
  Top 0.203: 92.99,35.84 82.83,35.84 81.56,34.57 D2.C | 92.99,35.84 94.26,34.57 D1.C | 92.99,35.84 105.06,35.84 106.33,34.57 D3.C
  Bottom 0.203: 3VOICE_RES_DIODE.3 91.72,16.79 92.99,18.06 92.99,32.67 94.26,33.94 D1.C
N$21
  Bottom 0.203: LINE-OUT_ON_OFF.3 104.42,80.93 100.61,77.12 100.61,67.59 89.82,56.8 U$2.PIN_3_(TIP)
N$22
  Bottom 0.203: R14.P$1 30.76,74.58 27.59,77.75 27.59,87.28 26.95,87.91 23.78,87.91 23.78,86.64 TOUCH_VOLUME.P$2
N$23
  Top 0.203: R4.P$2 89.82,28.86 89.82,26.32 R8.P$2
  Bottom 0.203: R8.P$2 89.18,25.68 89.18,19.97 86.01,16.79 3VOICE_RES_DIODE.1 85.37,16.79 85.37,17.43 77.12,25.68 R5.P$2
N$24  (via drill 0.51)
  Top 0.203: U$1.P15 68.86,9.81 70.13,8.54 73.94,8.54 74.58,9.17 74.58,18.7 63.15,18.7 U$1.P8 62.51,18.7 57.43,18.7 | 57.43,18.7 57.43,12.35 U$1.P7 | v51.08,42.19 50.45,42.19 42.83,49.81 IC2.9 | 57.43,18.7 v56.16,18.7
  Bottom 0.203: IC2.9 42.19,50.45 39.65,52.99 39.65,59.34 C15.2 | v51.08,42.19 52.35,40.92 52.35,22.51 v56.16,18.7
N$25
  Top 0.203: C14.1 66.32,43.46 66.32,48.54 65.05,49.81 65.05,53.62 70.77,53.62 71.4,52.99 82.83,52.99 96.8,66.96 110.14,66.96 111.41,68.23 111.41,75.21 107.6,75.21 101.88,80.93 LINE-OUT_ON_OFF.2
N$26
  Bottom 0.203: LED2.A 58.07,56.16 62.51,60.61 62.51,63.15 R17.P$2
N$27  (via drill 0.51)
  Top 0.203: v70.13,56.16 68.23,54.26 57.43,54.26 55.53,56.16 42.83,56.16 41.56,54.89 C13.1
  Bottom 0.203: C9.1 71.4,65.05 71.4,57.43 v70.13,56.16 70.13,54.26 70.77,53.62 70.77,47.27 75.21,42.83 75.21,40.92 77.12,40.92 77.75,41.56 77.75,46.64 80.93,49.81 U1.5
N$28  (via drill 0.51)
  Top 0.203: 72.67,13.62 72.67,9.81 U$1.P17 | 63.15,12.98 62.51,12.98 U$1.P9 62.51,13.62 v58.7,17.43 | 63.15,12.98 65.05,12.98 65.69,12.35 U$1.P10 | 72.67,13.62 69.5,16.79 66.96,16.79 63.15,12.98 | 72.67,13.62 U$1.P18 | 41.56,35.84 52.99,35.84 54.26,34.57 R16.P$1 | 41.56,35.84 33.94,35.84 32.67,34.57 D4.A | 41.56,35.84 41.56,32.67 38.38,29.49 R6.P$1
  Bottom 0.203: IC2.8 44.73,49.81 44.73,47.27 41.56,44.1 41.56,32.67 38.38,29.49 R6.P$1 | v58.7,17.43 52.99,23.14 52.99,32.67 54.26,33.94 R16.P$1
N$29  (via drill 0.51)
  Top 0.203: v52.35,79.66 33.94,98.07 32.03,98.07 J1.V+
  Bottom 0.203: v52.35,79.66 52.35,75.21 56.8,70.77 S11.2
N$30
  Top 0.203: 63.78,8.54 65.69,8.54 66.96,9.81 U$1.P14 | 63.78,8.54 56.8,8.54 55.53,9.81 U$1.P6 | IC2.10 39.65,49.81 34.57,44.73 32.03,44.73 31.4,44.1 31.4,37.11 18.7,37.11 17.43,35.84 17.43,34.57 19.97,34.57 D5.A | 63.78,8.54 63.78,6 33.3,6 24.41,14.89 23.14,14.89 21.87,16.16 21.87,26.32 25.05,26.32 R7.P$1
  Bottom 0.203: R7.P$1 25.05,26.95 20.6,31.4 20.6,33.94 D5.A
N$31
  Bottom 0.203: R13.P$2 35.21,28.86 33.94,27.59 33.94,25.05 34.57,24.41 33.3,23.14 30.13,23.14 30.13,39.65 26.32,43.46 26.32,86.01 TOUCH_VOLUME.P$3
N$32
  Top 0.203: C8.2 66.96,49.81 72.67,44.1 77.12,44.1 78.39,42.83 U1.3
N$33  (via drill 0.51)
  Top 0.203: v61.88,79.66 50.45,91.09 49.81,91.09 LS1.+
  Bottom 0.203: v61.88,79.66 61.88,75.85 67.59,70.13 67.59,66.96 68.86,65.69 C9.2
N$34  (via drill 0.51)
  Top 0.203: v68.23,71.4 66.32,71.4 65.69,72.04 47.91,72.04 C12.1
  Bottom 0.203: v68.23,71.4 80.93,71.4 80.93,54.89 76.48,50.45 U1.7
N$35
  Bottom 0.203: S6.1 94.9,27.59 100.61,33.3 100.61,39.02 VR3.P$3
N$36  (via drill 0.51)
  Top 0.203: v67.59,52.35 68.23,51.72 72.04,51.72 73.31,50.45 U1.8
  Bottom 0.203: v67.59,52.35 67.59,58.07 C10.1
N$37
  Bottom 0.203: C10.2 65.05,58.07 65.05,42.83 65.69,42.19 70.77,42.19 72.04,43.46 73.31,43.46 73.31,42.83 U1.1
N$38  (via drill 0.51)
  Top 0.203: v72.04,42.19 63.15,42.19 56.8,48.54 49.81,48.54 44.1,54.26 C13.2
  Bottom 0.203: v72.04,42.19 76.48,37.75 78.39,37.75 R10.P$2
N$39  (via drill 0.51)
  Top 0.203: v61.88,73.94 41.56,73.94 R14.P$2 | R12.P$2 86.64,50.45 84.74,48.54 70.77,48.54 69.5,49.81 C8.1
  Bottom 0.203: C14.2 68.86,43.46 68.86,49.81 C8.1 68.86,50.45 68.86,59.34 66.96,61.24 66.96,68.86 v61.88,73.94
N$40  (via drill 0.51)
  Top 0.203: v69.5,11.71 67.59,11.71 U$1.P12 | v36.48,32.03 10.44,32.03 8.54,33.94 D6.A | 45.37,25.05 45.37,25.68 39.02,25.68 R9.P$1 | 45.37,25.05 45.37,24.41 | 45.37,24.41 45.37,17.43 U$1.P2 | 45.37,25.05 34.57,25.05 33.94,25.68 33.3,25.68 32.03,24.41 32.03,19.33 42.83,8.54 46,8.54 51.08,13.62 U$1.P4 | 45.37,24.41 72.04,24.41 76.48,28.86 R18.P$1
  Bottom 0.203: v69.5,11.71 75.21,17.43 75.21,27.59 76.48,28.86 R18.P$1 | IC2.12 35.21,49.81 36.48,48.54 v36.48,32.03 36.48,30.13 37.11,29.49 37.11,27.59 38.38,26.32 R9.P$1
N$41  (via drill 0.51)
  Top 0.203: v81.56,72.04 75.85,77.75 16.79,77.75 13.62,80.93 AMP_ON_OFF.2
  Bottom 0.203: v81.56,72.04 81.56,52.99 79.02,50.45 U1.6
N$42
  Bottom 0.203: LED1.A 3.46,57.43 12.35,48.54 25.68,48.54 25.68,38.38 29.49,34.57 29.49,23.14 30.13,22.51 44.1,22.51 44.1,33.94 R16.P$2
N$43
  Top 0.203: 26.32,32.67 27.59,33.94 D5.C | 26.32,32.67 17.43,32.67 16.16,33.94 D6.C | 26.32,32.67 33.3,32.67 33.94,33.3 39.02,33.3 39.65,33.94 D4.C
  Bottom 0.203: RES_IR_DIODES_TOUCH.3 29.49,16.79 28.22,18.06 28.22,33.94 D5.C
N$44  (via drill 0.51)
  Top 0.203: v68.86,15.52 68.86,12.98 U$1.P13 | v62.51,7.27 53.62,7.27 53.62,11.71 U$1.P5 | v52.35,69.5 40.29,69.5 C16.2
  Bottom 0.203: IC2.11 37.11,50.45 33.94,53.62 33.94,76.48 37.75,80.29 39.02,80.29 39.02,70.77 39.65,70.13 C16.2 | v62.51,7.27 68.86,13.62 v68.86,15.52 63.78,20.6 63.78,47.91 52.99,58.7 52.99,63.15 R17.P$1 52.35,63.78 v52.35,69.5
N$45
  Bottom 0.203: RES_IR_DIODES_TOUCH.2 26.95,16.79 26.95,27.59 25.68,28.86 R13.P$1
N$46  (via drill 0.51)
  Top 0.203: v66.96,15.52 66.96,14.25 U$1.P11 | v62.51,19.97 51.08,19.97 49.18,18.06 49.18,17.43 U$1.P3 48.54,16.79 48.54,15.52 47.27,14.25 U$1.P1 42.83,14.25 42.83,24.41 v33.3,24.41 | IC2.13 32.67,50.45 32.67,66.96 42.19,66.96 42.83,67.59 75.21,67.59 77.12,69.5 C17.2
  Bottom 0.203: v62.51,19.97 v66.96,15.52 | v33.3,24.41 33.3,32.67 33.94,33.3 33.94,48.54 32.67,49.81 IC2.13
N$47
  Bottom 0.203: LED3.A 111.41,56.8 103.15,48.54 89.18,48.54 89.18,40.29 81.56,32.67 75.21,32.67 75.21,34.57 73.94,35.84 72.04,35.84 72.04,33.94 66.96,28.86 R18.P$2
N$48
  Bottom 0.203: R11.P$2 70.77,34.57 71.4,35.21 71.4,35.84 72.04,36.48 77.75,36.48 78.39,35.84 83.47,35.84 83.47,83.47 87.91,87.91 93.63,87.91 93.63,86.64 3_VOICE_VOLUME.P$3
RES_OR_DIODES_3_VOICES  (via drill 0.51)
  Top 0.203: v84.1,32.67 61.88,32.67 60.61,33.94 R11.P$1
  Bottom 0.203: v84.1,32.67 91.09,32.67 91.09,18.7 89.18,16.79 3VOICE_RES_DIODE.2
VCC  (via drill 0.51)
  Top 0.203: v58.7,66.32 59.34,66.96 73.94,66.96 75.85,65.05 C1.1 | v49.81,70.77 54.26,70.77 S11.3
  Bottom 0.203: v58.7,66.32 54.89,70.13 S11.3 | C11.1 72.04,54.89 73.31,56.16 73.31,61.88 75.85,64.42 C1.1 | 28.22,87.28 28.22,86.01 32.67,81.56 32.67,52.99 30.13,50.45 IC2.14 | 28.22,87.28 26.95,88.55 16.16,88.55 16.16,81.56 AMP_ON_OFF.3 | v49.81,70.77 49.18,71.4 49.18,73.31 35.21,87.28 28.22,87.28

### Text on the board
tPlace: Osc. range 2 | < Touch / Pad / Volume | Three > / Oscillator / Volume | < amp. off/on | Line-out off/on > | HST1d 2018 / FERAL / TECHNOLOGIES | Osc. range 1 | Osc. range 3 | Designed by / John R Ferguson | Queensland / Conservatorium / Griffith University | Pitch 1 | Pitch 3 | Pitch 2 | ^ Pot/LDR | ^ Pot/LDR | ^ Pot/LDR | Resistors/ / Diodes | Resistors/ / Diodes
bPlace: Power off/on